# Altium schematic sheet Vout.SchDoc
size A4; SheetNumber: 3; SheetTotal: 10
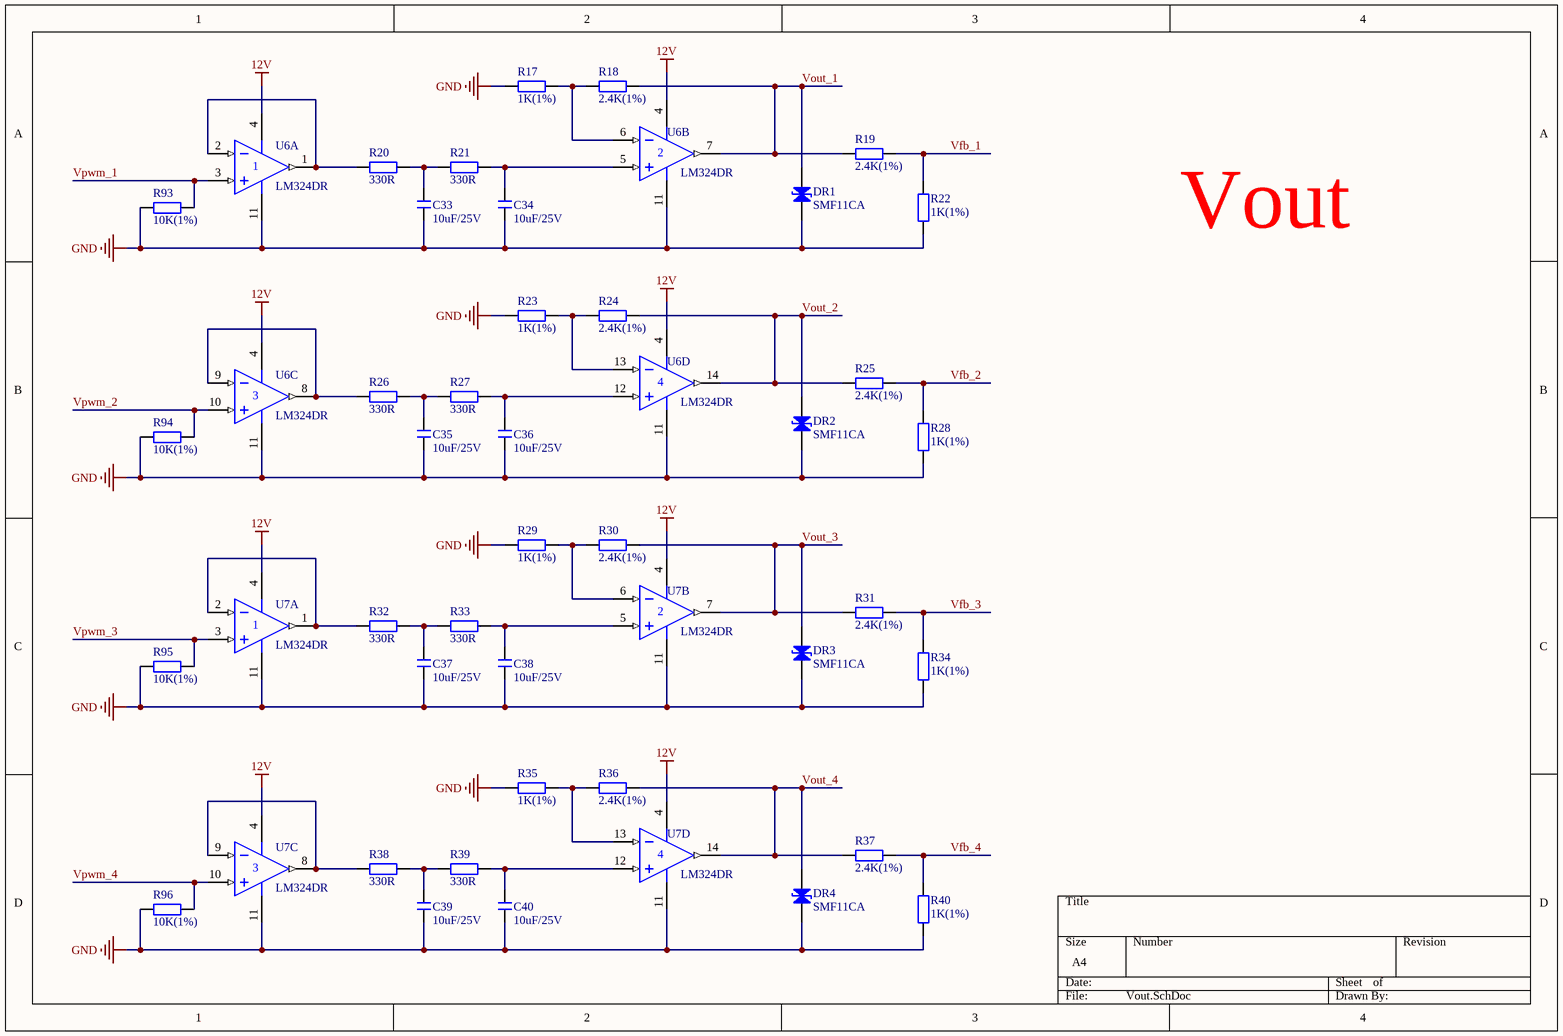
[diagram p0: Vout.SchDoc]

## Parts
C33  10uF/25V  [C 0603_L]
C34  10uF/25V  [C 0603_L]
C35  10uF/25V  [C 0603_L]
C36  10uF/25V  [C 0603_L]
C37  10uF/25V  [C 0603_L]
C38  10uF/25V  [C 0603_L]
C39  10uF/25V  [C 0603_L]
C40  10uF/25V  [C 0603_L]
DR1  SMF11CA  [SOD-123F]
DR2  SMF11CA  [SOD-123F]
DR3  SMF11CA  [SOD-123F]
DR4  SMF11CA  [SOD-123F]
R17  1K(1%)  [R 0603_L]
R18  2.4K(1%)  [R 0603_L]
R19  2.4K(1%)  [R 0603_L]
R20  330R  [R 0603_L]
R21  330R  [R 0603_L]
R22  1K(1%)  [R 0603_L]
R23  1K(1%)  [R 0603_L]
R24  2.4K(1%)  [R 0603_L]
R25  2.4K(1%)  [R 0603_L]
R26  330R  [R 0603_L]
R27  330R  [R 0603_L]
R28  1K(1%)  [R 0603_L]
R29  1K(1%)  [R 0603_L]
R30  2.4K(1%)  [R 0603_L]
R31  2.4K(1%)  [R 0603_L]
R32  330R  [R 0603_L]
R33  330R  [R 0603_L]
R34  1K(1%)  [R 0603_L]
R35  1K(1%)  [R 0603_L]
R36  2.4K(1%)  [R 0603_L]
R37  2.4K(1%)  [R 0603_L]
R38  330R  [R 0603_L]
R39  330R  [R 0603_L]
R40  1K(1%)  [R 0603_L]
R93  10K(1%)  [R 0603_L]
R94  10K(1%)  [R 0603_L]
R95  10K(1%)  [R 0603_L]
R96  10K(1%)  [R 0603_L]
U6  LM324DR  [D014_N]  (parts A,B,C,D of 4)
U7  LM324DR  [D014_N]  (parts A,B,C,D of 4)

## Nets
12V: U6.4(V+) U7.4(V+)
GND: C33.1 C34.1 C35.1 C36.1 C37.1 C38.1 C39.1 C40.1 DR1.2(K) DR2.2(K) DR3.2(K) DR4.2(K) R17.2 R22.1 R23.2 R28.1 R29.2 R34.1 R35.2 R40.1 R93.1 R94.1 R95.1 R96.1 U6.11(V-) U7.11(V-)
Vfb_1: R19.1 R22.2
Vfb_2: R25.1 R28.2
Vfb_3: R31.1 R34.2
Vfb_4: R37.1 R40.2
Vout_1: DR1.1(A) R18.1 R19.2 U6.7(OUT)
Vout_2: DR2.1(A) R24.1 R25.2 U6.14(OUT)
Vout_3: DR3.1(A) R30.1 R31.2 U7.7(OUT)
Vout_4: DR4.1(A) R36.1 R37.2 U7.14(OUT)
Vpwm_1: R93.2 U6.3(IN+)
Vpwm_2: R94.2 U6.10(IN+)
Vpwm_3: R95.2 U7.3(IN+)
Vpwm_4: R96.2 U7.10(IN+)
NetC33_2: C33.2 R20.1 R21.2
NetC34_2: C34.2 R21.1 U6.5(IN+)
NetC35_2: C35.2 R26.1 R27.2
NetC36_2: C36.2 R27.1 U6.12(IN+)
NetC37_2: C37.2 R32.1 R33.2
NetC38_2: C38.2 R33.1 U7.5(IN+)
NetC39_2: C39.2 R38.1 R39.2
NetC40_2: C40.2 R39.1 U7.12(IN+)
NetR17_1: R17.1 R18.2 U6.6(IN-)
NetR20_2: R20.2 U6.1(OUT) U6.2(IN-)
NetR23_1: R23.1 R24.2 U6.13(IN-)
NetR26_2: R26.2 U6.8(OUT) U6.9(IN-)
NetR29_1: R29.1 R30.2 U7.6(IN-)
NetR32_2: R32.2 U7.1(OUT) U7.2(IN-)
NetR35_1: R35.1 R36.2 U7.13(IN-)
NetR38_2: R38.2 U7.8(OUT) U7.9(IN-)

## Notes on the sheet
- Vout

## Library data of the parts
C33-C40 = C: 无极性贴片电容; 版权归属: 源创客; BOM名称: 无极性贴片电容; 学习资源: www.ooocke.com
DR1-DR4 = DR: 瞬态电压抑制二极管; 版权归属: 源创客; BOM名称: 瞬态电压抑制二极管; 学习资源: www.ooocke.com
R17-R40 R93-R96 = R: 贴片电阻; 版权归属: 源创客; BOM名称: 贴片电阻; 学习资源: www.ooocke.com
U6 U7 = LM324DR: Quadruple Operational Amplifier; Published: 15-Apr-2002; LatestRevisionDate: 13-Apr-2006; LatestRevisionNote: IPC-7351 Footprint Added.; DatasheetVersion: Jan-1989; PackageVersion: Jan-1998; PackageReference: D014; Publisher: Altium Limited; PackageDescription: 14-Pin Small Outline Integrated Circuit 1.27 mm Pitch; Code_IPC: SOIC127P600-14; ComponentLink1Description: Manufacturer Link; ComponentLink1URL: http://www.ti.com/; ComponentLink2Description: Datasheet; ComponentLink2URL: http://www-s.ti.com/sc/ds/lm324.pdf